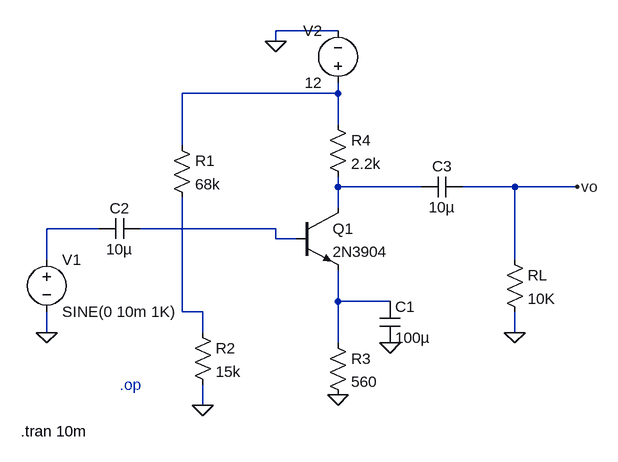
[diagram p0: schematic emmiter_amply.asc]
emmiter_amply.asc, the LTspice schematic file:
Version 4.1
SHEET 1 924 680
WIRE 512 -208 416 -208
WIRE 416 -192 416 -208
WIRE 512 -112 512 -128
WIRE 512 -112 272 -112
WIRE 512 -64 512 -112
WIRE 272 -32 272 -112
WIRE 512 32 512 16
WIRE 640 32 512 32
WIRE 784 32 704 32
WIRE 880 32 784 32
WIRE 512 64 512 32
WIRE 144 96 64 96
WIRE 416 96 208 96
WIRE 416 112 416 96
WIRE 448 112 416 112
WIRE 64 144 64 96
WIRE 784 144 784 32
WIRE 512 208 512 160
WIRE 592 208 512 208
WIRE 272 224 272 48
WIRE 304 224 272 224
WIRE 64 256 64 224
WIRE 304 256 304 224
WIRE 784 256 784 224
WIRE 512 272 512 208
WIRE 304 368 304 336
FLAG 304 368 0
FLAG 64 256 0
FLAG 784 256 0
FLAG 880 32 vo
FLAG 416 -192 0
FLAG 512 352 0
FLAG 592 272 0
SYMBOL voltage 64 128 R0
WINDOW 123 0 0 Left 0
WINDOW 39 0 0 Left 0
SYMATTR InstName V1
SYMATTR Value SINE(0 10m 1K)
SYMBOL npn 448 64 R0
SYMATTR InstName Q1
SYMATTR Value 2N3904
SYMBOL res 256 -48 R0
SYMATTR InstName R1
SYMATTR Value 68k
SYMBOL res 288 240 R0
SYMATTR InstName R2
SYMATTR Value 15k
SYMBOL res 496 256 R0
SYMATTR InstName R3
SYMATTR Value 560
SYMBOL res 496 -80 R0
SYMATTR InstName R4
SYMATTR Value 2.2k
SYMBOL cap 208 80 R90
WINDOW 0 0 32 VBottom 2
WINDOW 3 32 32 VTop 2
SYMATTR InstName C2
SYMATTR Value 10µ
SYMBOL cap 704 16 R90
WINDOW 0 0 32 VBottom 2
WINDOW 3 32 32 VTop 2
SYMATTR InstName C3
SYMATTR Value 10µ
SYMBOL res 768 128 R0
SYMATTR InstName RL
SYMATTR Value 10K
SYMBOL voltage 512 -112 R180
WINDOW 0 24 96 Left 2
WINDOW 3 24 16 Left 2
WINDOW 123 0 0 Left 0
WINDOW 39 0 0 Left 0
SYMATTR InstName V2
SYMATTR Value 12
SYMBOL cap 576 208 R0
SYMATTR InstName C1
SYMATTR Value 100µ
TEXT 24 408 Left 2 !.tran 10m
TEXT 176 336 Left 2 ;.op

The netlist it stands for:
* emmiter_amply.asc
V1 N003 0 SINE(0 10m 1K)
Q1 N002 N004 N005 0 2N3904
R1 N001 N006 68k
R2 N006 0 15k
R3 N005 0 560
R4 N001 N002 2.2k
C2 N004 N003 10µ
C3 vo N002 10µ
RL vo 0 10K
V2 N001 0 12
C1 N005 0 100µ
.model NPN NPN
.model PNP PNP
.lib standard.bjt
.tran 10m
* .op
.backanno
.end